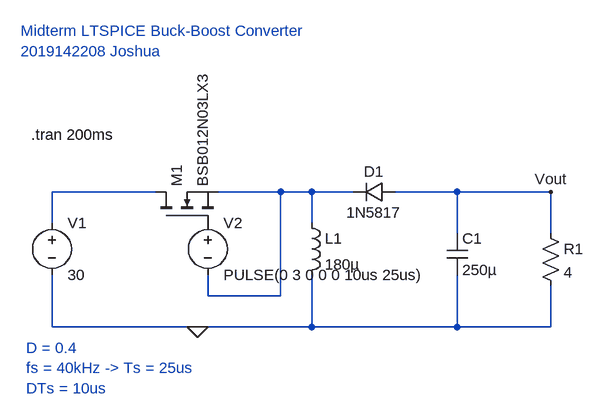
[diagram p0: schematic BUCK BOOST CONVERTER.asc]
BUCK BOOST CONVERTER.asc, the LTspice schematic file:
Version 4
SHEET 1 880 680
WIRE 112 240 -48 240
WIRE 304 240 208 240
WIRE 352 240 304 240
WIRE 416 240 352 240
WIRE 576 240 480 240
WIRE 720 240 576 240
WIRE -48 288 -48 240
WIRE 352 288 352 240
WIRE 576 304 576 240
WIRE 720 304 720 240
WIRE 192 400 192 368
WIRE 304 400 304 240
WIRE 304 400 192 400
WIRE -48 448 -48 368
WIRE 176 448 -48 448
WIRE 352 448 352 368
WIRE 352 448 176 448
WIRE 576 448 576 368
WIRE 576 448 352 448
WIRE 720 448 720 384
WIRE 720 448 576 448
FLAG 176 448 0
FLAG 720 240 Vout
SYMBOL voltage -48 272 R0
SYMATTR InstName V1
SYMATTR Value 30
SYMBOL voltage 192 272 R0
SYMATTR InstName V2
SYMATTR Value PULSE(0 3 0 0 0 10us 25us)
SYMBOL nmos 112 288 R270
SYMATTR InstName M1
SYMATTR Value BSB012N03LX3
SYMBOL diode 480 224 R90
WINDOW 0 0 32 VBottom 2
WINDOW 3 32 32 VTop 2
SYMATTR InstName D1
SYMATTR Value 1N5817
SYMBOL ind 336 272 R0
SYMATTR InstName L1
SYMATTR Value 180µ
SYMBOL cap 560 304 R0
SYMATTR InstName C1
SYMATTR Value 250µ
SYMBOL res 704 288 R0
SYMATTR InstName R1
SYMATTR Value 4
TEXT -80 152 Left 2 !.tran 200ms
TEXT -96 -8 Left 2 ;Midterm LTSPICE Buck-Boost Converter\n2019142208 Joshua
TEXT -88 480 Left 2 ;D = 0.4\nfs = 40kHz -> Ts = 25us\nDTs = 10us

The netlist it stands for:
* BUCK BOOST CONVERTER.asc
V1 N001 0 30
V2 P001 N002 PULSE(0 3 0 0 0 10us 25us)
M1 N001 P001 N002 N002 BSB012N03LX3
D1 Vout N002 1N5817
L1 N002 0 180µ
C1 Vout 0 250µ
R1 Vout 0 4
.model D D
.lib standard.dio
.model NMOS NMOS
.model PMOS PMOS
.lib standard.mos
.tran 200ms
* Midterm LTSPICE Buck-Boost Converter
* 2019142208 Joshua
* D = 0.4
* fs = 40kHz -> Ts = 25us
* DTs = 10us
.backanno
.end